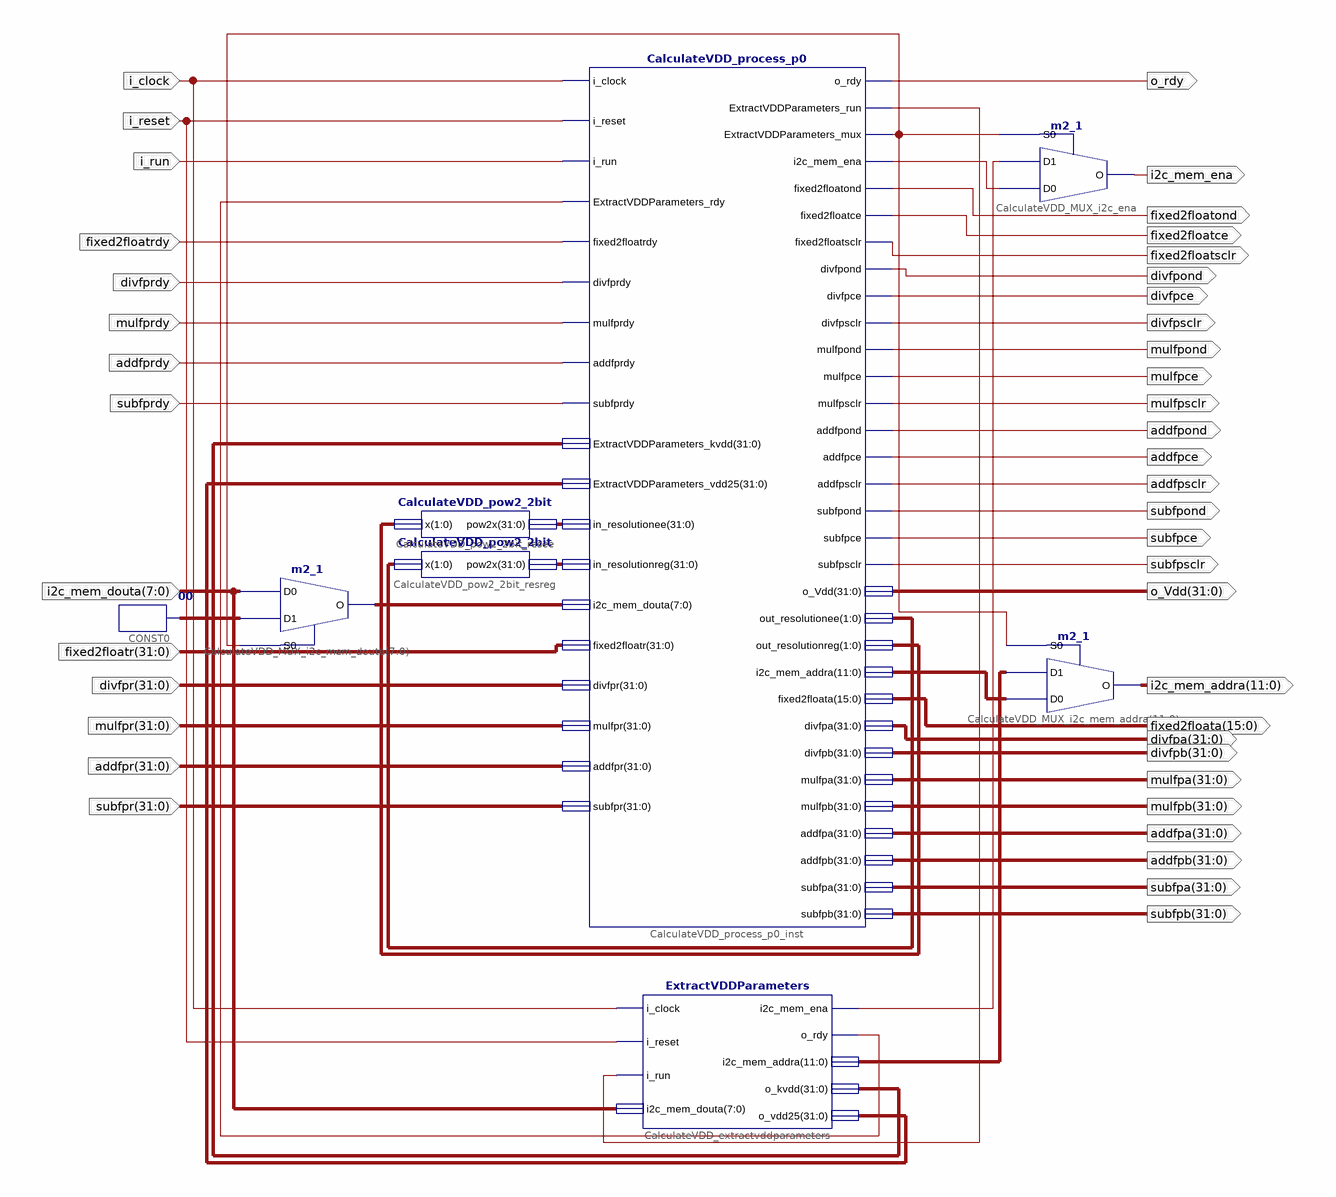
[diagram p0: schematic sheet 1]
// Xilinx ISE schematic CalculateVDD_1.sch (virtex4) as structural Verilog: 8 symbols, 42 ports
module CalculateVDD_1 (
  input  [7:0] i2c_mem_douta,
  input  i_run,
  input  fixed2floatrdy,
  input  divfprdy,
  input  mulfprdy,
  input  addfprdy,
  input  subfprdy,
  input  [31:0] divfpr,
  input  [31:0] mulfpr,
  input  [31:0] addfpr,
  input  [31:0] subfpr,
  input  i_reset,
  input  i_clock,
  input  [31:0] fixed2floatr,
  output i2c_mem_ena,
  output [11:0] i2c_mem_addra,
  output o_rdy,
  output fixed2floatsclr,
  output mulfpond,
  output mulfpce,
  output mulfpsclr,
  output addfpond,
  output addfpce,
  output addfpsclr,
  output subfpond,
  output subfpce,
  output subfpsclr,
  output divfpsclr,
  output divfpce,
  output divfpond,
  output fixed2floatce,
  output fixed2floatond,
  output [31:0] o_Vdd,
  output [15:0] fixed2floata,
  output [31:0] divfpa,
  output [31:0] divfpb,
  output [31:0] mulfpa,
  output [31:0] mulfpb,
  output [31:0] addfpa,
  output [31:0] addfpb,
  output [31:0] subfpa,
  output [31:0] subfpb
);

  wire ExractVDDParameters_rdy, XLXN_9, XLXN_11, XLXN_22, XLXN_27;
  wire [1:0] XLXN_3, XLXN_6;
  wire [7:0] CONST0, XLXN_17;
  wire [11:0] XLXN_23, XLXN_24;
  wire [31:0] ExtractVDDParameters_kvdd, ExtractVDDParameters_vdd25, XLXN_15, XLXN_16;

  CalculateVDD_process_p0 CalculateVDD_process_p0_inst (
    .i_clock(i_clock), .i_reset(i_reset), .i_run(i_run), .ExtractVDDParameters_rdy(ExractVDDParameters_rdy),
    .fixed2floatrdy(fixed2floatrdy), .divfprdy(divfprdy), .mulfprdy(mulfprdy), .addfprdy(addfprdy),
    .subfprdy(subfprdy), .ExtractVDDParameters_kvdd(ExtractVDDParameters_kvdd),
    .ExtractVDDParameters_vdd25(ExtractVDDParameters_vdd25), .in_resolutionee(XLXN_15),
    .in_resolutionreg(XLXN_16), .i2c_mem_douta(XLXN_17), .fixed2floatr(fixed2floatr), .divfpr(divfpr),
    .mulfpr(mulfpr), .addfpr(addfpr), .subfpr(subfpr), .o_rdy(o_rdy), .ExtractVDDParameters_run(XLXN_27),
    .ExtractVDDParameters_mux(XLXN_9), .i2c_mem_ena(XLXN_22), .fixed2floatond(fixed2floatond),
    .fixed2floatce(fixed2floatce), .fixed2floatsclr(fixed2floatsclr), .divfpond(divfpond), .divfpce(divfpce),
    .divfpsclr(divfpsclr), .mulfpond(mulfpond), .mulfpce(mulfpce), .mulfpsclr(mulfpsclr),
    .addfpond(addfpond), .addfpce(addfpce), .addfpsclr(addfpsclr), .subfpond(subfpond), .subfpce(subfpce),
    .subfpsclr(subfpsclr), .o_Vdd(o_Vdd), .out_resolutionee(XLXN_3), .out_resolutionreg(XLXN_6),
    .i2c_mem_addra(XLXN_23), .fixed2floata(fixed2floata), .divfpa(divfpa), .divfpb(divfpb), .mulfpa(mulfpa),
    .mulfpb(mulfpb), .addfpa(addfpa), .addfpb(addfpb), .subfpa(subfpa), .subfpb(subfpb));
  ExtractVDDParameters CalculateVDD_extractvddparameters (
    .i_clock(i_clock), .i_reset(i_reset), .i_run(XLXN_27), .i2c_mem_douta(i2c_mem_douta),
    .i2c_mem_ena(XLXN_11), .o_rdy(ExractVDDParameters_rdy), .i2c_mem_addra(XLXN_24),
    .o_kvdd(ExtractVDDParameters_kvdd), .o_vdd25(ExtractVDDParameters_vdd25));
  CalculateVDD_pow2_2bit CalculateVDD_pow2_2bit_resreg (.x(XLXN_3), .pow2x(XLXN_16));
  CalculateVDD_pow2_2bit CalculateVDD_pow2_2bit_resee (.x(XLXN_6), .pow2x(XLXN_15));
  m2_1 CalculateVDD_MUX_i2c_mem_douta[7:0] (.D0(i2c_mem_douta), .D1(CONST0), .S0(XLXN_9), .O(XLXN_17));
  m2_1 CalculateVDD_MUX_i2c_mem_addra[11:0] (.D0(XLXN_23), .D1(XLXN_24), .S0(XLXN_9), .O(i2c_mem_addra));
  m2_1 CalculateVDD_MUX_i2c_ena (.D0(XLXN_22), .D1(XLXN_11), .S0(XLXN_9), .O(i2c_mem_ena));
  constant #(.CValue("00")) u_CONST0 (.O(CONST0));
endmodule
